# Altium schematic sheet MAB17.SchDoc
size A4
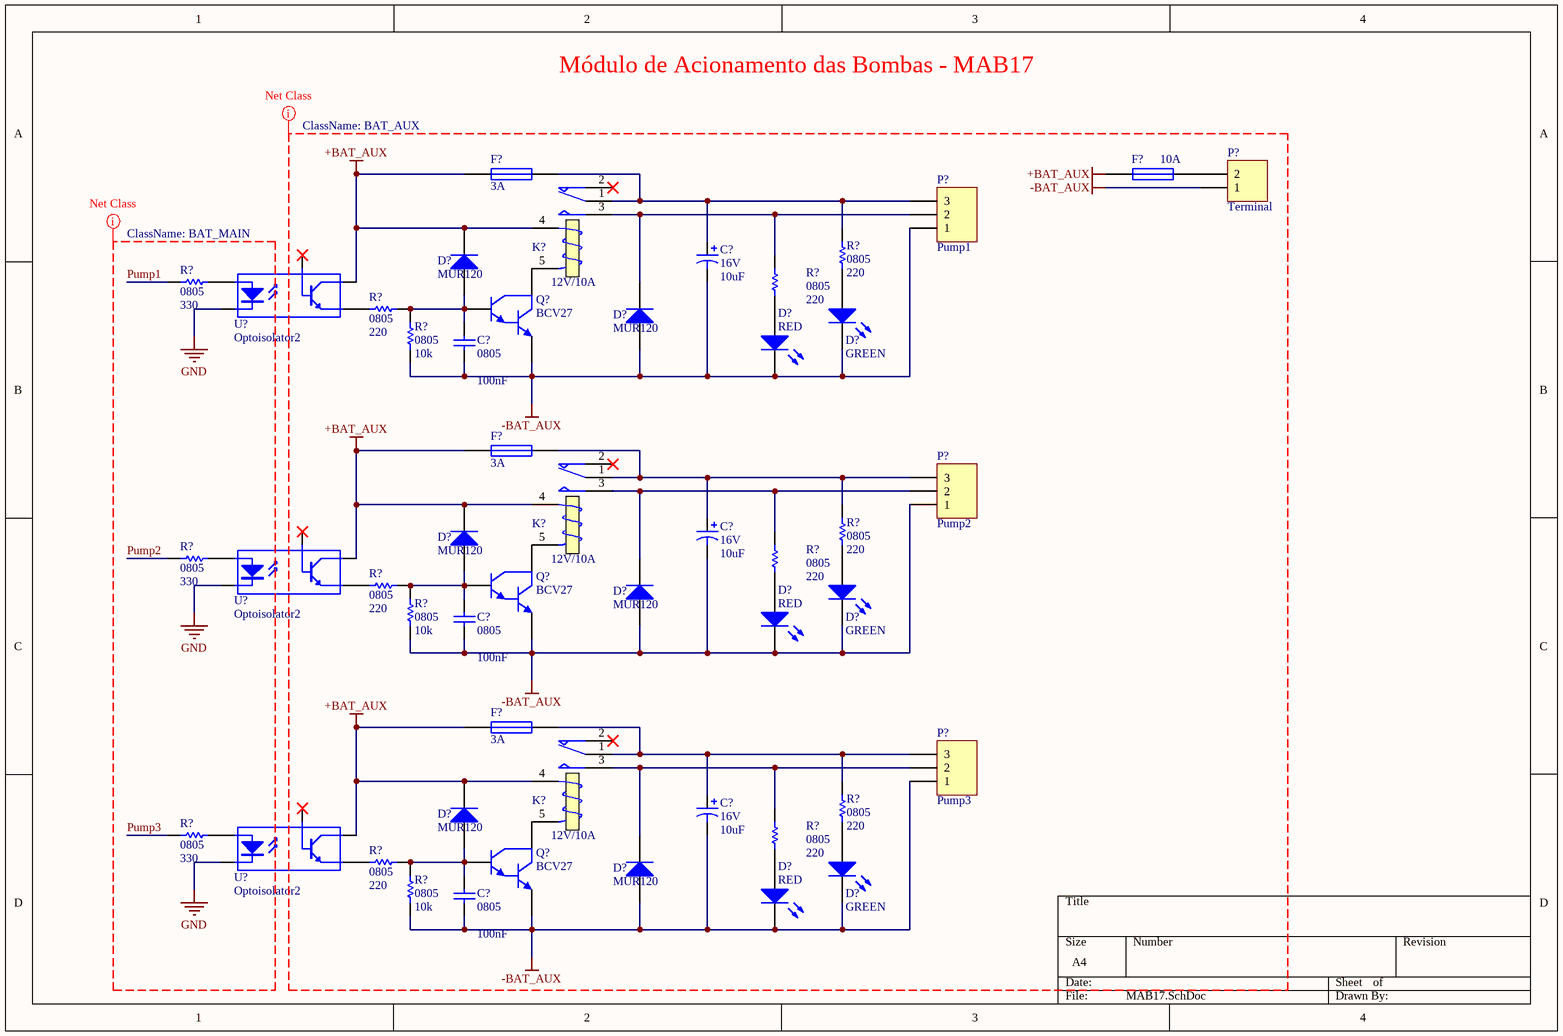
[diagram p0: MAB17.SchDoc]

## Parts
(Parts that share a designator on the sheet are numbered #1, #2 ... from top to bottom, then left to right.)
C?#1  16V  value 10uF  [RB7.6-15]
C?#2  0805  value 100nF  [RAD-0.3]
C?#3  16V  value 10uF  [RB7.6-15]
C?#4  0805  value 100nF  [RAD-0.3]
C?#5  16V  value 10uF  [RB7.6-15]
C?#6  0805  value 100nF  [RAD-0.3]
D?#1  MUR120  [DIO10.2-7x2.7]
D?#2  GREEN  [DSO-C2/D5.6]
D?#3  MUR120  [DIO10.2-7x2.7]
D?#4  RED  [DSO-C2/D5.6]
D?#5  MUR120  [DIO10.2-7x2.7]
D?#6  GREEN  [DSO-C2/D5.6]
D?#7  MUR120  [DIO10.2-7x2.7]
D?#8  RED  [DSO-C2/D5.6]
D?#9  MUR120  [DIO10.2-7x2.7]
D?#10  GREEN  [DSO-C2/D5.6]
D?#11  MUR120  [DIO10.2-7x2.7]
D?#12  RED  [DSO-C2/D5.6]
F?#1  3A  [Porta Fusivel]
F?#2  10A  [Porta Fusivel]
F?#3  3A  [Porta Fusivel]
F?#4  3A  [Porta Fusivel]
K?#1  12V/10A  [RELE]
K?#2  12V/10A  [RELE]
K?#3  12V/10A  [RELE]
P?#1  Terminal  [KRE_2]
P?#2  Pump1  [KRE_3]
P?#3  Pump2  [KRE_3]
P?#4  Pump3  [KRE_3]
Q?#1  BCV27  [SOT95P240-3N]
Q?#2  BCV27  [SOT95P240-3N]
Q?#3  BCV27  [SOT95P240-3N]
R?#1  0805  value 330  [AXIAL-0.3]
R?#2  0805  value 220  [AXIAL-0.3]
R?#3  0805  value 220  [AXIAL-0.3]
R?#4  0805  value 220  [AXIAL-0.3]
R?#5  0805  value 10k  [AXIAL-0.3]
R?#6  0805  value 330  [AXIAL-0.3]
R?#7  0805  value 220  [AXIAL-0.3]
R?#8  0805  value 220  [AXIAL-0.3]
R?#9  0805  value 220  [AXIAL-0.3]
R?#10  0805  value 10k  [AXIAL-0.3]
R?#11  0805  value 330  [AXIAL-0.3]
R?#12  0805  value 220  [AXIAL-0.3]
R?#13  0805  value 220  [AXIAL-0.3]
R?#14  0805  value 220  [AXIAL-0.3]
R?#15  0805  value 10k  [AXIAL-0.3]
U?#1  Optoisolator2  [SOT26A-6L]
U?#2  Optoisolator2  [SOT26A-6L]
U?#3  Optoisolator2  [SOT26A-6L]

## Nets
+BAT_AUX: D?#1.2(K) D?#5.2(K) D?#9.2(K) F?#1.2 F?#2.2 F?#3.2 F?#4.2 K?#1.4(T1) K?#2.4(T1) K?#3.4(T1) U?#1.5(C) U?#2.5(C) U?#3.5(C)
-BAT_AUX: C?#1.2 C?#2.1 C?#3.2 C?#4.1 C?#5.2 C?#6.1 D?#2.2(K) D?#3.1(A) D?#4.2(K) D?#6.2(K) D?#7.1(A) D?#8.2(K) D?#10.2(K) D?#11.1(A) D?#12.2(K) P?#1.1 P?#2.1 P?#3.1 P?#4.1 Q?#1.3(E) Q?#2.3(E) Q?#3.3(E) R?#5.1 R?#10.1 R?#15.1
GND: U?#1.3(K) U?#2.3(K) U?#3.3(K)
Pump1: R?#1.1
Pump2: R?#6.1
Pump3: R?#11.1
NetC?#1_1: C?#1.1 F?#1.1 K?#1.1(COM) P?#2.3 R?#2.2
NetC?#2_2: C?#2.2 D?#1.1(A) Q?#1.2(B) R?#3.2 R?#5.2
NetC?#3_1: C?#3.1 F?#3.1 K?#2.1(COM) P?#3.3 R?#7.2
NetC?#4_2: C?#4.2 D?#5.1(A) Q?#2.2(B) R?#8.2 R?#10.2
NetC?#5_1: C?#5.1 F?#4.1 K?#3.1(COM) P?#4.3 R?#12.2
NetC?#6_2: C?#6.2 D?#9.1(A) Q?#3.2(B) R?#13.2 R?#15.2
NetD?#2_1: D?#2.1(A) R?#2.1
NetD?#3_2: D?#3.2(K) K?#1.3(NO) P?#2.2 R?#4.2
NetD?#4_1: D?#4.1(A) R?#4.1
NetD?#6_1: D?#6.1(A) R?#7.1
NetD?#7_2: D?#7.2(K) K?#2.3(NO) P?#3.2 R?#9.2
NetD?#8_1: D?#8.1(A) R?#9.1
NetD?#10_1: D?#10.1(A) R?#12.1
NetD?#11_2: D?#11.2(K) K?#3.3(NO) P?#4.2 R?#14.2
NetD?#12_1: D?#12.1(A) R?#14.1
NetF?#2_1: F?#2.1 P?#1.2
NetK?#1_5: K?#1.5(T2) Q?#1.1(C)
NetK?#2_5: K?#2.5(T2) Q?#2.1(C)
NetK?#3_5: K?#3.5(T2) Q?#3.1(C)
NetR?#1_2: R?#1.2 U?#1.1(A)
NetR?#3_1: R?#3.1 U?#1.4(E)
NetR?#6_2: R?#6.2 U?#2.1(A)
NetR?#8_1: R?#8.1 U?#2.4(E)
NetR?#11_2: R?#11.2 U?#3.1(A)
NetR?#13_1: R?#13.1 U?#3.4(E)

Not connected (* = marked no-connect by the designer): K?#1 2(NC)*; K?#2 2(NC)*; K?#3 2(NC)*; U?#1 6(B)*; U?#2 6(B)*; U?#3 6(B)*

## Layout directives
net class BAT_AUX: +BAT_AUX, -BAT_AUX
net class BAT_MAIN: GND, Pump1, Pump2, Pump3

## Notes on the sheet
- Módulo de Acionamento das Bombas - MAB17

## Library data of the parts
C?#1 C?#3 C?#5 = Cap Pol1: Polarized Capacitor (Radial); Published: 8-Jun-2000; LatestRevisionDate: 17-Jul-2002; LatestRevisionNote: Re-released for DXP Platform.; PackageReference: RB7.6-15; Publisher: Altium Limited
C?#2 C?#4 C?#6 = Cap: Capacitor; Published: 8-Jun-2000; LatestRevisionDate: 17-Jul-2002; LatestRevisionNote: Re-released for DXP Platform.; PackageReference: RAD-0.3; Publisher: Altium Limited
D?#1 D?#3 D?#5 D?#7 D?#9 D?#11 = Diode: Default Diode; Published: 8-Jun-2000; LatestRevisionDate: 17-Jul-2002; LatestRevisionNote: Re-released for DXP Platform.; PackageVersion: Sep-1996; PackageReference: SMC; Publisher: Altium Limited; Code_JEDEC: DO-214-AB
D?#2 D?#4 D?#6 D?#8 D?#10 D?#12 = LED3: Typical BLUE SiC LED; Published: 8-Jun-2000; LatestRevisionDate: 17-Dec-2003; LatestRevisionNote: PCB Footprint replaced.; DatasheetVersion: 16-Apr-2002; PackageVersion: 16-Apr-2002; PackageReference: 3.5X2.8X1.9; Publisher: Altium Limited
F?#1-F?#4 = Fuse 1: Fuse; Published: 8-Jun-2000; LatestRevisionDate: 17-Jul-2002; LatestRevisionNote: Re-released for DXP Platform.; PackageReference: PIN-W2/E2.8; Publisher: Altium Limited
K?#1-K?#3 = Relay: SPDT Relay; Published: 8-Jun-2000; LatestRevisionDate: 17-Jul-2002; LatestRevisionNote: Re-released for DXP Platform.; PackageReference: MODULE5B; Publisher: Altium Limited
P?#1 = KRE_2: Terminal Block 1x2
P?#2-P?#4 = Header 3: Header, 3-Pin; LatestRevisionDate: 17-Jul-2002; LatestRevisionNote: Re-released for DXP Platform.; Publisher: Altium Limited
Q?#1-Q?#3 = NPN1: NPN Darlington Bipolar Transistor; Published: 8-Jun-2000; LatestRevisionDate: 17-Jul-2002; LatestRevisionNote: Re-released for DXP Platform.; DatasheetVersion: 1989; PackageVersion: 1989; PackageReference: TO-92; Publisher: Altium Limited; Code_JEDEC: TO-92
R?#1-R?#15 = Res1: Resistor; Published: 8-Jun-2000; LatestRevisionDate: 17-Jul-2002; LatestRevisionNote: Re-released for DXP Platform.; PackageReference: AXIAL-0.3; Publisher: Altium Limited
U?#1-U?#3 = Optoisolator2: 5 Pin Mini Flat Pack Optocoupler; pin to pad: 3>2; Published: 24-Mar-1999; LatestRevisionDate: 04-Mar-2005; LatestRevisionNote: PCB Footprint replaced, Sch pins re-numbered.; DatasheetVersion: Apr-2004; PackageReference: SOP5(6); Publisher: Altium Limited